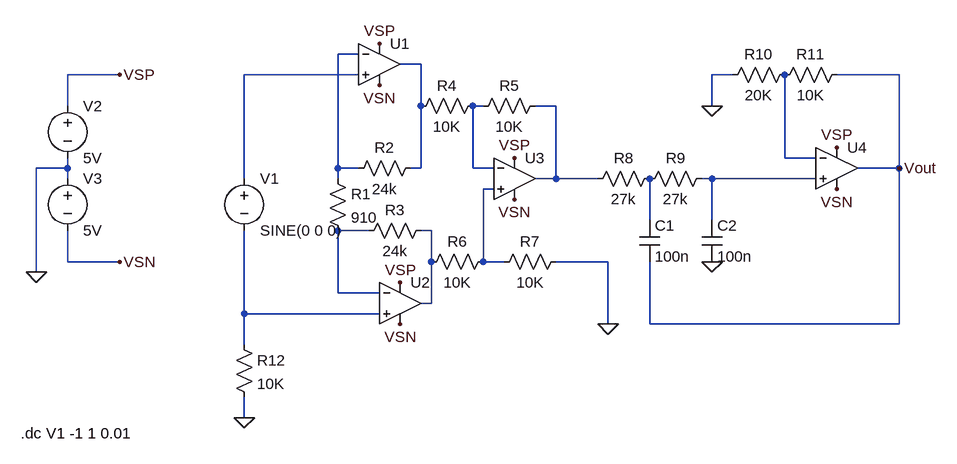
[diagram p0: schematic circuit.asc]
circuit.asc, the LTspice schematic file:
Version 4
SHEET 1 1340 680
WIRE 464 -160 432 -160
WIRE 560 -144 528 -144
WIRE 96 -128 16 -128
WIRE 464 -128 288 -128
WIRE 1040 -128 1008 -128
WIRE 1296 -128 1200 -128
WIRE 16 -80 16 -128
WIRE 560 -80 560 -144
WIRE 656 -80 640 -80
WIRE 768 -80 736 -80
WIRE 1008 -80 1008 -128
WIRE 1120 0 1120 -128
WIRE 1168 0 1120 0
WIRE 16 16 16 0
WIRE 16 16 -32 16
WIRE 432 16 432 -160
WIRE 464 16 432 16
WIRE 560 16 560 -80
WIRE 560 16 544 16
WIRE 640 16 640 -80
WIRE 672 16 640 16
WIRE 1296 16 1296 -128
WIRE 1296 16 1232 16
WIRE 16 32 16 16
WIRE 288 32 288 -128
WIRE 432 32 432 16
WIRE 768 32 768 -80
WIRE 768 32 736 32
WIRE 832 32 768 32
WIRE 1008 32 992 32
WIRE 1168 32 1008 32
WIRE 672 48 656 48
WIRE 912 96 912 32
WIRE 1008 96 1008 32
WIRE 480 112 432 112
WIRE 576 112 560 112
WIRE 16 160 16 112
WIRE 96 160 16 160
WIRE 576 160 576 112
WIRE 656 160 656 48
WIRE 688 160 656 160
WIRE 848 160 768 160
WIRE -32 176 -32 16
WIRE 432 208 432 112
WIRE 496 208 432 208
WIRE 576 224 576 160
WIRE 576 224 560 224
WIRE 288 240 288 112
WIRE 496 240 288 240
WIRE 848 256 848 160
WIRE 912 256 912 160
WIRE 1296 256 1296 16
WIRE 1296 256 912 256
WIRE 288 288 288 240
WIRE 288 400 288 368
FLAG -32 176 0
FLAG 848 256 0
FLAG 96 160 VSN
FLAG 96 -128 VSP
FLAG 1008 160 0
FLAG 1008 -80 0
FLAG 528 256 VSN
FLAG 704 64 VSN
FLAG 496 -112 VSN
FLAG 1200 48 VSN
FLAG 1200 -16 VSP
FLAG 704 0 VSP
FLAG 528 192 VSP
FLAG 496 -176 VSP
FLAG 288 400 0
FLAG 1296 16 Vout
SYMBOL voltage 16 -96 R0
SYMATTR InstName V2
SYMATTR Value 5V
SYMBOL voltage 16 16 R0
SYMATTR InstName V3
SYMATTR Value 5V
SYMBOL OpAmps\\UniversalOpamp2 496 -144 R0
SYMATTR InstName U1
SYMBOL OpAmps\\UniversalOpamp2 528 224 R0
SYMATTR InstName U2
SYMBOL OpAmps\\UniversalOpamp2 704 32 R0
SYMATTR InstName U3
SYMBOL res 416 16 R0
SYMATTR InstName R1
SYMATTR Value 910
SYMBOL res 560 0 R90
WINDOW 0 0 56 VBottom 2
WINDOW 3 32 56 VTop 2
SYMATTR InstName R2
SYMATTR Value 24k
SYMBOL res 576 96 R90
WINDOW 0 0 56 VBottom 2
WINDOW 3 32 56 VTop 2
SYMATTR InstName R3
SYMATTR Value 24k
SYMBOL res 656 -96 R90
WINDOW 0 0 56 VBottom 2
WINDOW 3 32 56 VTop 2
SYMATTR InstName R4
SYMATTR Value 10K
SYMBOL res 752 -96 R90
WINDOW 0 0 56 VBottom 2
WINDOW 3 32 56 VTop 2
SYMATTR InstName R5
SYMATTR Value 10K
SYMBOL res 672 144 R90
WINDOW 0 0 56 VBottom 2
WINDOW 3 32 56 VTop 2
SYMATTR InstName R6
SYMATTR Value 10K
SYMBOL res 784 144 R90
WINDOW 0 0 56 VBottom 2
WINDOW 3 32 56 VTop 2
SYMATTR InstName R7
SYMATTR Value 10K
SYMBOL res 928 16 R90
WINDOW 0 0 56 VBottom 2
WINDOW 3 32 56 VTop 2
SYMATTR InstName R8
SYMATTR Value 27k
SYMBOL res 1008 16 R90
WINDOW 0 0 56 VBottom 2
WINDOW 3 32 56 VTop 2
SYMATTR InstName R9
SYMATTR Value 27k
SYMBOL res 1136 -144 R90
WINDOW 0 0 56 VBottom 2
WINDOW 3 32 56 VTop 2
SYMATTR InstName R10
SYMATTR Value 20K
SYMBOL res 1216 -144 R90
WINDOW 0 0 56 VBottom 2
WINDOW 3 32 56 VTop 2
SYMATTR InstName R11
SYMATTR Value 10K
SYMBOL cap 896 96 R0
SYMATTR InstName C1
SYMATTR Value 100n
SYMBOL cap 992 96 R0
SYMATTR InstName C2
SYMATTR Value 100n
SYMBOL OpAmps\\UniversalOpamp2 1200 16 R0
SYMATTR InstName U4
SYMBOL res 272 272 R0
SYMATTR InstName R12
SYMATTR Value 10K
SYMBOL voltage 288 16 R0
WINDOW 123 0 0 Left 0
WINDOW 39 0 0 Left 0
SYMATTR InstName V1
SYMATTR Value SINE(0 0 0)
TEXT -56 424 Left 2 !.dc V1 -1 1 0.01

The netlist it stands for:
* circuit.asc
V2 VSP 0 5V
V3 0 VSN 5V
XU1 N003 N001 VSP VSN N002 level.2 Avol=1Meg GBW=10Meg Slew=10Meg ilimit=25m rail=0 Vos=0 phimargin=45 en=0 enk=0 in=0 ink=0 Rin=500Meg  ; pins IN+ IN- V+ V- OUT
XU2 N012 N010 VSP VSN N011 level.2 Avol=1Meg GBW=10Meg Slew=10Meg ilimit=25m rail=0 Vos=0 phimargin=45 en=0 enk=0 in=0 ink=0 Rin=500Meg  ; pins IN+ IN- V+ V- OUT
XU3 N008 N004 VSP VSN N005 level.2 Avol=1Meg GBW=10Meg Slew=10Meg ilimit=25m rail=0 Vos=0 phimargin=45 en=0 enk=0 in=0 ink=0 Rin=500Meg  ; pins IN+ IN- V+ V- OUT
R1 N001 N010 910
R2 N002 N001 24k
R3 N011 N010 24k
R4 N004 N002 10K
R5 N005 N004 10K
R6 N008 N011 10K
R7 0 N008 10K
R8 N009 N005 27k
R9 N007 N009 27k
R10 N006 0 20K
R11 Vout N006 10K
C1 N009 Vout 100n
C2 N007 0 100n
XU4 N007 N006 VSP VSN Vout level.2 Avol=1Meg GBW=10Meg Slew=10Meg ilimit=25m rail=0 Vos=0 phimargin=45 en=0 enk=0 in=0 ink=0 Rin=500Meg  ; pins IN+ IN- V+ V- OUT
R12 N012 0 10K
V1 N003 N012 SINE(0 0 0)
.dc V1 -1 1 0.01
.lib UniversalOpamps2.sub
.backanno
.end